# EasyEDA Pro project 多组分NO.2.eprj, board PCB1
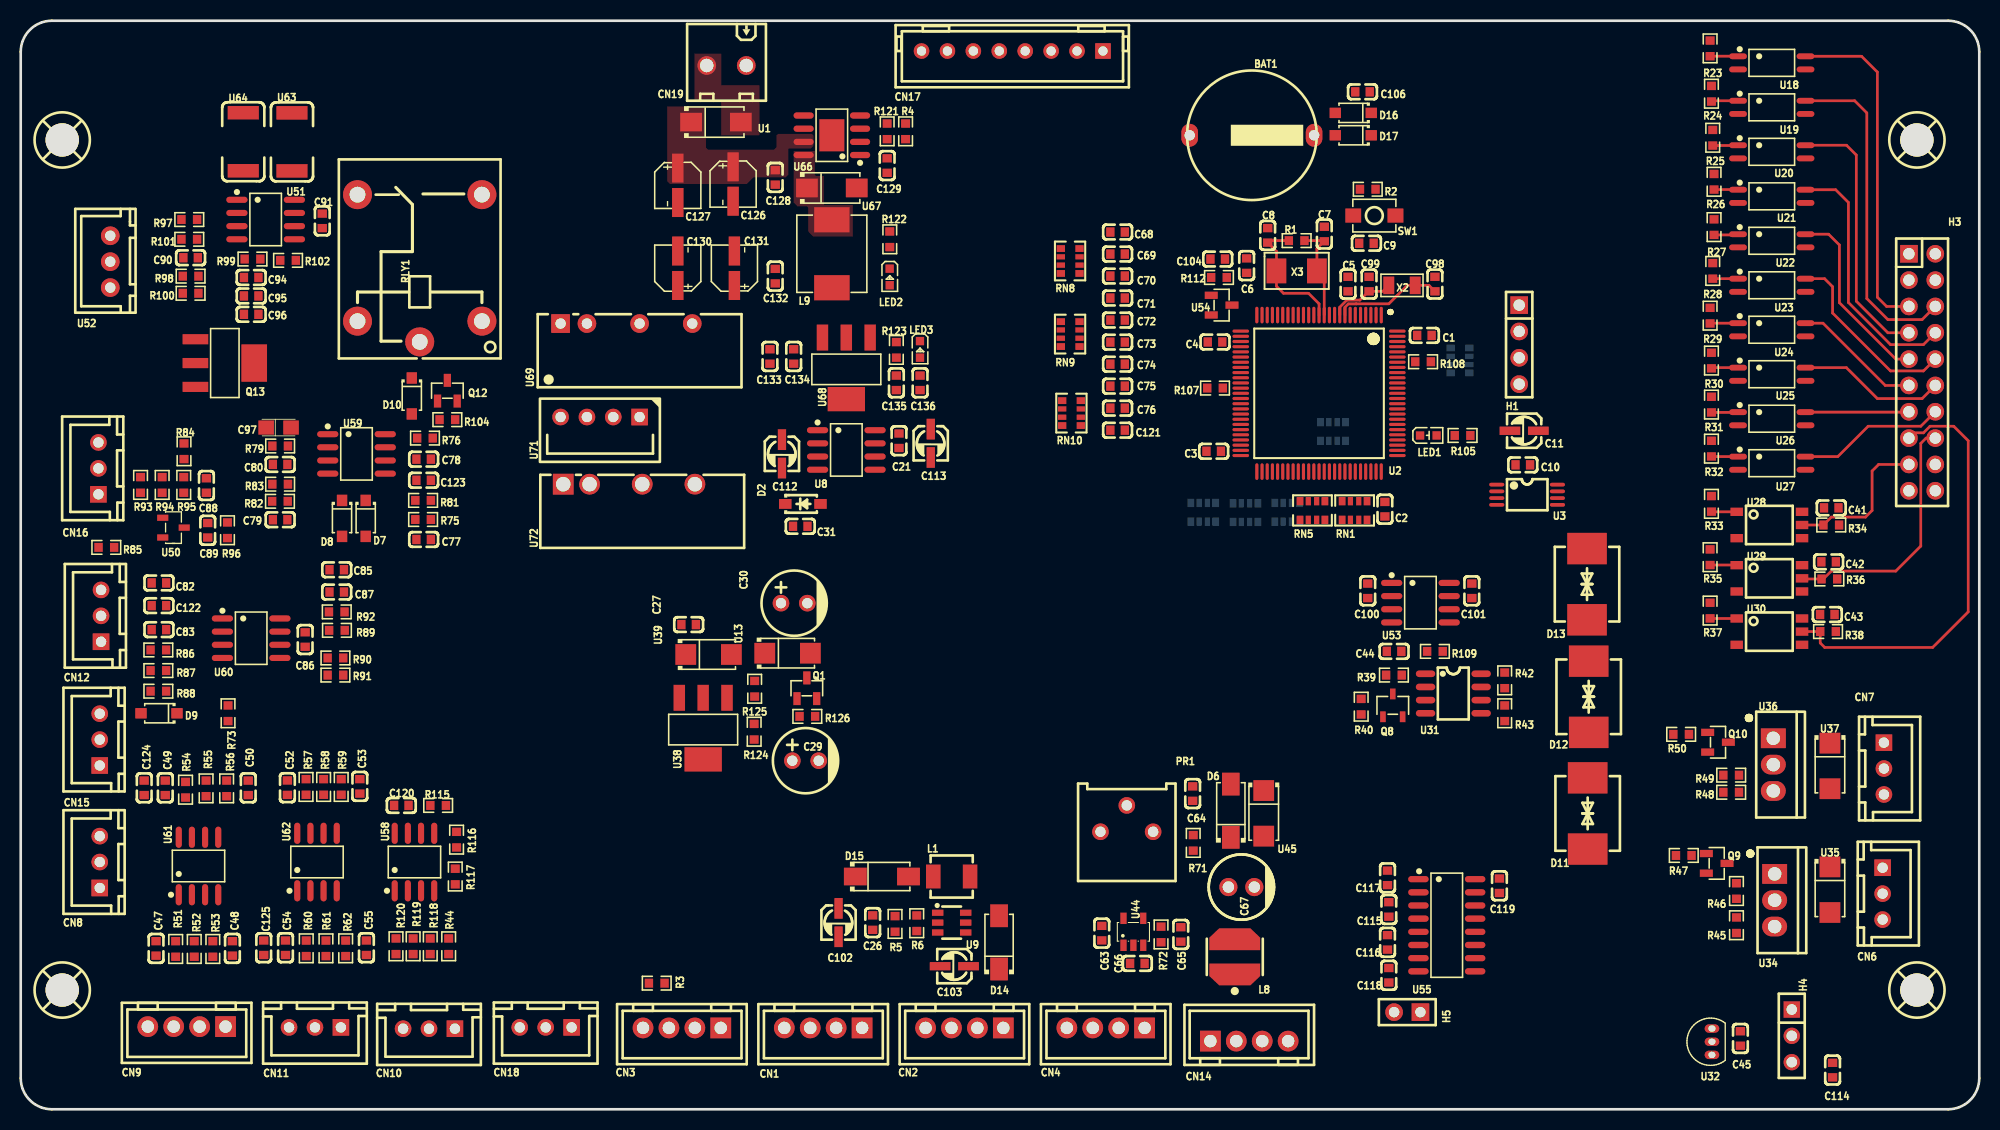
[diagram p5: board, top side]
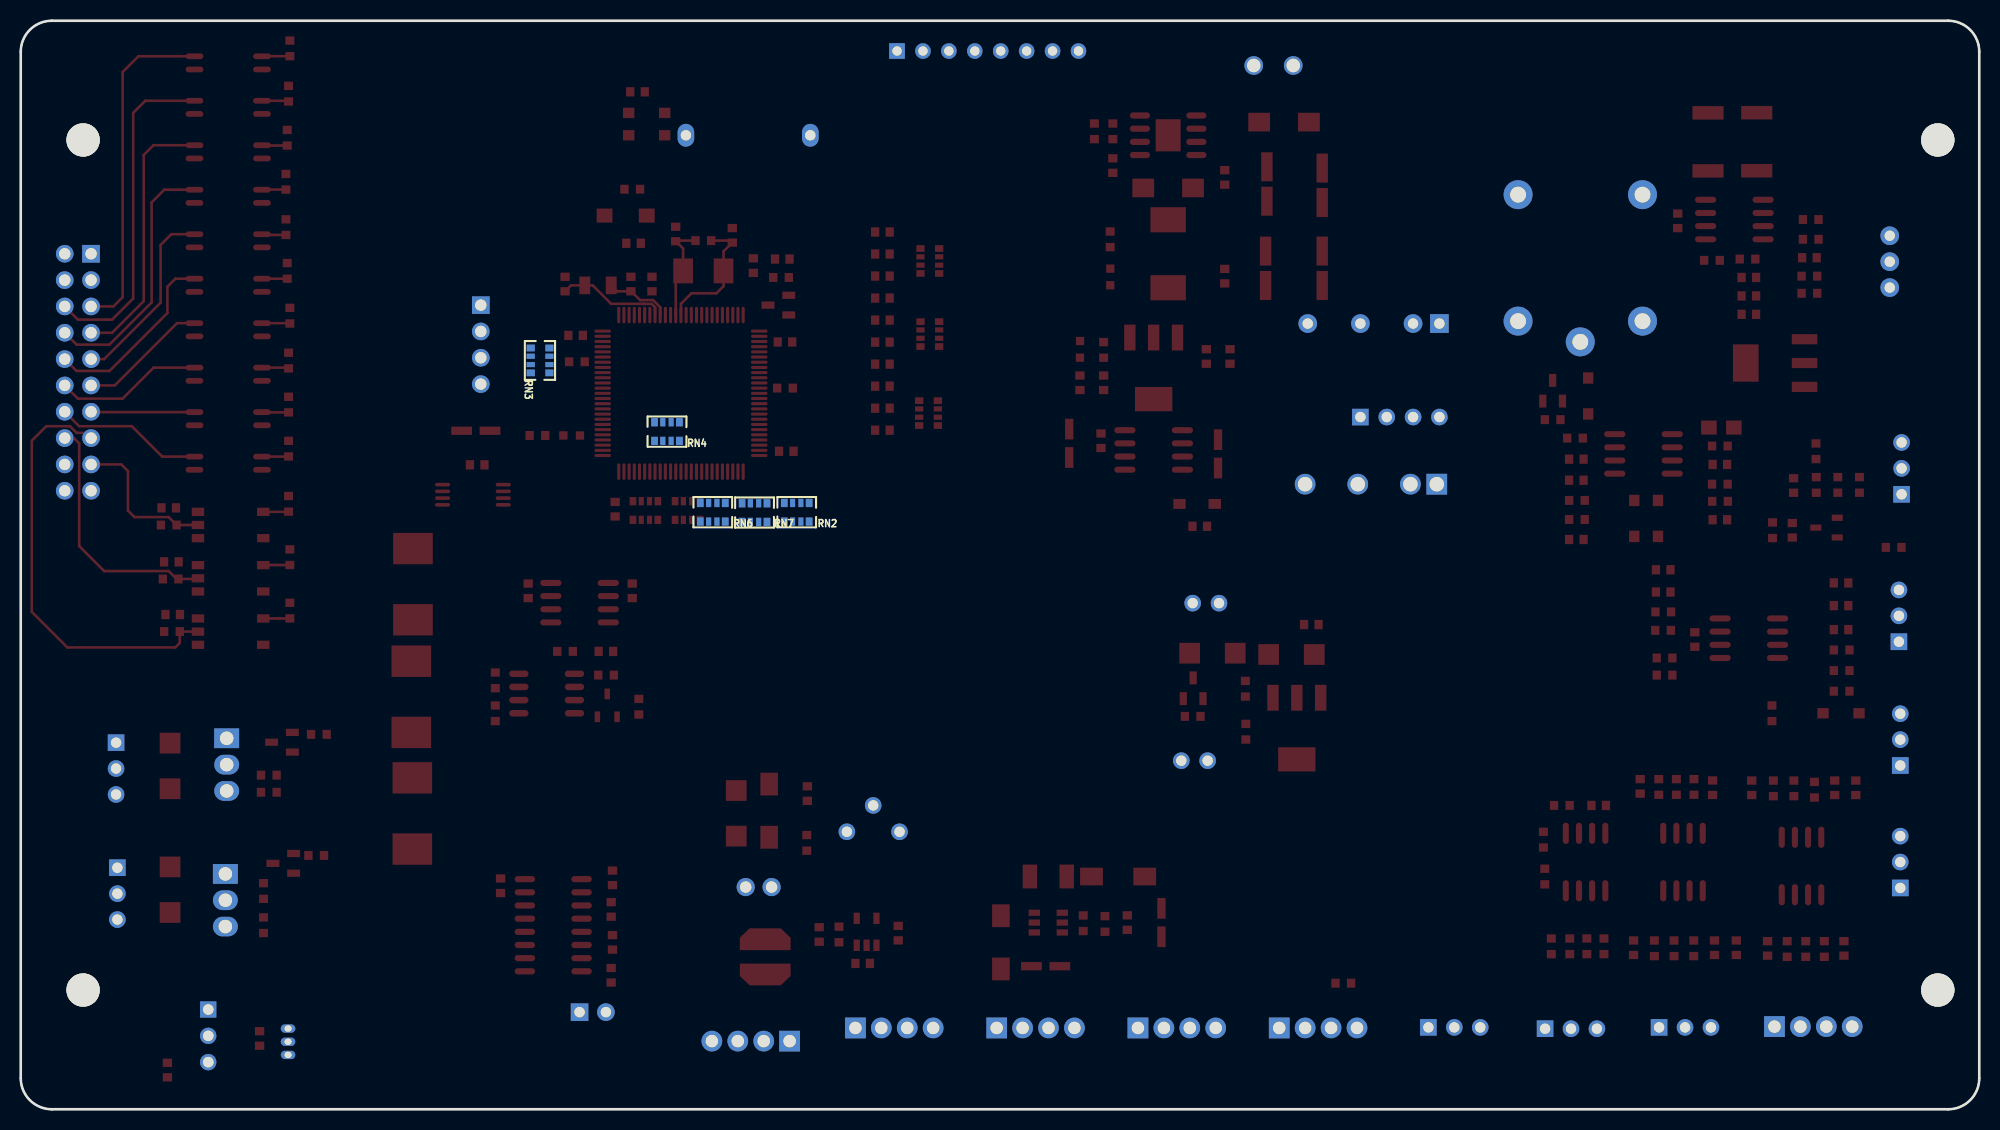
[diagram p6: board, bottom side, seen from below]

Outline 188.9 x 105 mm; copper layers: Top Layer, Bottom Layer. Coordinates in mm from the lower left corner of the outline.
Outline path: 0,102 0,3 arc(0.88,0.88) 3,0 185.9,0 arc(188.02,0.88) 188.9,3 188.9,102 arc(188.02,104.12) 185.9,105 3,105 arc(0.88,104.12) 0,102
Stack: Top Layer 0.035mm / Dielectric1 1.51mm FR4 er 4.5 / Bottom Layer 0.035mm

## Design rules (mm)
template: JLCPCB Capability(Two Layers Board)
spacing copperThickness1oz (default): track to track 0.102, other pairs 0.152 to 0.3
spacing copperThickness2oz: track to track 0.203, other pairs 0.152 to 0.3
track width copperThickness1oz (default): min 0.127, default 0.254, max 2.54
track width copperThickness2oz: min 0.203, default 0.254, max 2.54
differential pair differentialPair (default): width min 0.127, default 0.254, max 2.54; gap min 0.152, default 0.152
via viaSize (default): diameter min 0.5, default 0.61, max 10; hole min 0.3, default 0.305, max 6.3

## Placement (name value [footprint] x y rotation side)
BAT1  CR1220  [TH_BD12.5-P12.0-RD-CR1220]  118.75 93.95 0 top
C1  104  [C0603]  135.38 74.65 0 top
C2  100nF  [C0603]  131.57 57.88 270 top
C3  100nF  [C0603]  115.06 63.47 180 top
C4  100nF  [C0603]  115.19 74.01 180 top
C5  100nF  [C0603]  128.02 79.6 90 top
C6  100nF  [C0603]  118.24 81.38 90 top
C7  30pf  [C0603]  125.73 84.43 90 top
C8  30pf  [C0603]  120.27 84.3 90 top
C9  104  [C0603]  129.79 83.54 0 top
C10  104  [C0603]  144.87 62.16 180 top
C11  10uF/10V  [C_Ele_SMD_3x5.4mm]  145 65.46 0 top
C21  10uF  [C0603]  84.71 64.49 90 top
C26  104  [C0603]  82.17 18 90 top
C27  104  [C0603]  64.42 46.75 180 top
C29  220uF/25V  [CAP-TH_BD6.3-P2.50-D1.0-FD]  75.69 33.63 0 top
C30  220uF/25V  [CAP-TH_BD6.3-P2.50-D1.0-FD]  74.6 48.82 0 top
C31  104  [C0603]  75.18 56.23 180 top
C41  104  [C0603]  174.62 58.01 180 top
C42  104  [C0603]  174.37 52.8 0 top
C43  104  [C0603]  174.24 47.72 0 top
C44  104  [C0603]  132.46 44.17 180 top
C45  104  [C0603]  165.86 6.83 90 top
C47  104  [C0603]  13.05 15.52 270 top
C48  105  [C0603]  20.42 15.52 270 top
C49  104  [C0603]  13.94 31.01 90 top
C50  105  [C0603]  21.94 31.01 270 top
C52  104  [C0603]  25.72 31.02 270 top
C53  105  [C0603]  32.71 31.15 270 top
C54  104  [C0603]  25.54 15.58 90 top
C55  105  [C0603]  33.34 15.58 270 top
C63  104  [C0603]  104.27 16.99 270 top
C64  104  [C0603]  113.03 30.45 270 top
C65  105  [C0603]  111.89 16.86 270 top
C66  104  [C0603]  107.7 14.07 180 top
C67  100uF/25V  [CAP-TH_BD6.3-P2.50-D0.6-FD]  117.73 21.43 0 top
C68  104  [C0603]  105.79 84.62 180 top
C69  104  [C0603]  105.79 82.5 180 top
C70  104  [C0603]  105.79 80.37 180 top
C71  104  [C0603]  105.79 78.25 180 top
C72  104  [C0603]  105.79 76.12 180 top
C73  104  [C0603]  105.79 74 180 top
C74  104  [C0603]  105.79 71.88 180 top
C75  104  [C0603]  105.79 69.75 180 top
C76  104  [C0603]  105.79 67.63 180 top
C77  104  [C0603]  38.86 54.96 0 top
C78  105  [C0603]  38.86 62.71 0 top
C79  104  [C0603]  25.02 56.87 180 top
C80  105  [C0603]  25.02 62.2 180 top
C82  104  [C0603]  13.33 50.77 180 top
C83  105  [C0603]  13.33 46.27 0 top
C85  104  [C0603]  30.48 52.04 0 top
C86  105  [C0603]  27.43 45.31 270 top
C87  104  [C0603]  30.48 49.89 0 top
C88  104  [C0603]  17.91 60.17 270 top
C89  104  [C0603]  18.03 55.85 270 top
C90  104  [C0603]  16.38 82.14 0 top
C91  104  [C0603]  29.08 85.7 90 top
C94  2.2uf  [C0603]  22.22 80.23 180 top
C95  2.2uf  [C0603]  22.22 78.46 180 top
C96  2.2uf  [C0603]  22.22 76.68 180 top
C97  10uF/10v  [CASE-A_3216]  24.87 65.76 0 top
C98  15pf  [C0603]  136.4 79.6 90 top
C99  15pf  [C0603]  130.05 79.6 90 top
C100  104  [C0603]  129.92 50.01 270 top
C101  104  [C0603]  139.95 50.01 270 top
C102  22uF/10V  [C_Ele_SMD_3x5.4mm]  78.87 18 90 top
C103  22uF/10V  [C_Ele_SMD_3x5.4mm]  90.04 13.81 0 top
C104  104  [C0603]  115.45 82.01 180 top
C106  104  [C0603]  129.41 98.14 0 top
C112  10uF/10V  [C_Ele_SMD_3x5.4mm]  73.41 63.22 90 top
C113  10uF/10V  [C_Ele_SMD_3x5.4mm]  87.76 64.23 90 top
C114  100nF  [C0603]  174.75 3.78 90 top
C115  104  [C0603]  131.95 19.28 90 top
C116  104  [C0603]  131.83 16.1 90 top
C117  104  [C0603]  131.83 22.32 90 top
C118  104  [C0603]  131.95 12.93 90 top
C119  104  [C0603]  142.62 21.56 90 top
C120  104  [C0603]  36.71 29.31 0 top
C121  104  [C0603]  105.79 65.5 180 top
C122  104  [C0603]  13.33 48.58 0 top
C123  104  [C0603]  38.86 60.68 180 top
C124  104  [C0603]  11.91 31.01 270 top
C125  104  [C0603]  23.43 15.58 270 top
C126  4.7uF  [CAP-SMD_BD4.0-L4.3-W4.3-FD]  68.71 89.25 270 top
C127  4.7uF  [CAP-SMD_BD4.0-L4.3-W4.3-FD]  63.37 89.12 270 top
C128  100nF  [C0603]  72.77 89.89 90 top
C129  100nF  [C0603]  83.57 91.03 270 top
C130  47uF  [CAP-SMD_BD4.0-L4.3-W4.3-FD]  63.37 81.12 90 top
C131  47uF  [CAP-SMD_BD4.0-L4.3-W4.3-FD]  68.83 81.12 90 top
C132  100nF  [C0603]  72.77 80.36 270 top
C133  10uF  [C0603]  72.26 72.61 90 top
C134  100nF  [C0603]  74.55 72.61 90 top
C135  10uF  [C0603]  84.46 70.08 90 top
C136  100nF  [C0603]  86.74 70.08 90 top
CN1  WAFER-XH254Z-4A  [CONN-TH_XH-4A]  77.4 7.84 180 top
CN2  WAFER-XH254Z-4A  [CONN-TH_XH-4A]  91.02 7.84 180 top
CN3  WAFER-XH254Z-4A  [CONN-TH_XH-4A]  63.77 7.84 180 top
CN4  WAFER-XH254Z-4A  [CONN-TH_XH-4A]  104.65 7.84 180 top
CN6  WAFER-XH254Z-3AM  [CONN-TH_3P-P2.50_JS25T-S03XHW-00]  179.58 20.8 270 top
CN7  WAFER-XH254Z-3AM  [CONN-TH_3P-P2.50_JS25T-S03XHW-00]  179.71 32.86 270 top
CN8  WAFER-XH254Z-3AM  [CONN-TH_3P-P2.50_JS25T-S03XHW-00]  7.62 23.85 90 top
CN9  WAFER-XH254Z-4A  [CONN-TH_XH-4A]  16 7.97 180 top
CN10  WAFER-XH254Z-3AM  [CONN-TH_3P-P2.50_JS25T-S03XHW-00]  39.38 7.77 180 top
CN11  WAFER-XH254Z-3AM  [CONN-TH_3P-P2.50_JS25T-S03XHW-00]  28.38 7.9 180 top
CN12  WAFER-XH254Z-3AM  [CONN-TH_3P-P2.50_JS25T-S03XHW-00]  7.75 47.6 90 top
CN14  WAFER-XH254Z-4A  [CONN-TH_XH-4A]  118.49 6.57 0 top
CN15  WAFER-XH254Z-3AM  [CONN-TH_3P-P2.50_JS25T-S03XHW-00]  7.62 35.66 90 top
CN16  WAFER-XH254Z-3AM  [CONN-TH_3P-P2.50_JS25T-S03XHW-00]  7.49 61.82 90 top
CN17  WAFER-XH254Z-8A  [CONN-TH_WAFER-XH254Z-8A]  95.63 102.08 180 top
CN18  WAFER-XH254Z-3AM  [CONN-TH_3P-P2.50_JS25T-S03XHW-00]  50.63 7.9 180 top
CN19  MX128L-3.81-02P-GN01-Cu-Y-A  [CONN-TH_2P-P3.81_MX128L-3.81-GN01-02P-CU-Y-A]  68.07 100.68 180 top
D2  BZT52C10  [SOD-123_L2.7-W1.6-LS3.7-RD-1]  75.44 58.39 0 top
D6  SS14  [SMA_L4.2-W2.6-LS5.3-RD]  116.71 28.8 90 top
D7  1N4148W  [SOD-123F_L2.7-W1.6-LS3.8-RD]  33.27 56.99 270 top
D8  1N4148W  [SOD-123F_L2.7-W1.6-LS3.8-RD]  30.99 56.99 270 top
D9  1N4148W  [SOD-123F_L2.7-W1.6-LS3.8-RD]  13.34 38.2 180 top
D10  1N4148W  [SOD-123F_L2.7-W1.6-LS3.8-RD]  37.72 68.81 270 top
D11  SMCJ6.5CA  [SMC_L6.9-W5.9-LS7.9-BI]  151.13 28.53 90 top
D12  SMCJ6.5CA  [SMC_L6.9-W5.9-LS7.9-BI]  151.23 39.79 90 top
D13  SMCJ6.5CA  [SMC_L6.9-W5.9-LS7.9-BI]  151.07 50.65 90 top
D14  SS14  [SMA_L4.2-W2.6-LS5.3-RD]  94.36 16.1 90 top
D15  SS14  [SMA_L4.2-W2.6-LS5.3-RD]  83.06 22.45 0 top
D16  1N4148W  [SOD-123F_L2.7-W1.6-LS3.8-RD]  128.52 96.11 180 top
D17  1N4148W  [SOD-123F_L2.7-W1.6-LS3.8-RD]  128.52 93.95 180 top
H1  -  [HDR-TH_4P-P2.54-V-M]  144.53 73.76 270 top
H3  -  [HDR-TH_20P-P2.54-V-R2-C10-S2.54]  183.39 71.09 270 top
H4  -  [HDR-TH_3P-P2.54-V-F]  170.81 7.08 270 top
H5  -  [HDR-TH_2P-P2.54-V-F]  133.73 9.37 180 top
L1  3.3uH  [IND-SMD_L4.5-W4.1_SL0420]  89.79 22.45 0 top
L8  100uH  [IND-SMD_L5.0-W5.0-VLCF5028T]  117.09 14.7 0 top
L9  15uH  [IND-SMD_L7.3-W6.6]  78.23 82.52 90 top
LED1  NCD0603G1  [LED0603-RD_1]  135.76 65 0 top
LED2  -  [LED_0603]  83.82 80.23 270 top
LED3  -  [LED_0603]  86.74 73.25 270 top
PR1  10K  [R_3386P]  106.68 26.77 270 top
Q1  SS8550  [SOT-23-3_L2.9-W1.3-P1.90-LS2.4-BR]  75.82 40.61 270 top
Q8  S8050  [SOT-23-3_L3.0-W1.7-P0.95-LS2.9-BR]  132.33 38.96 270 top
Q9  SS8550  [SOT-23-3_L2.9-W1.3-P1.90-LS2.4-BR]  163.58 23.72 180 top
Q10  SS8550  [SOT-23-3_L2.9-W1.3-P1.90-LS2.4-BR]  163.7 35.4 180 top
Q12  SS8550  [SOT-23-3_L2.9-W1.3-P1.90-LS2.4-BR]  41.15 69.31 270 top
Q13  BSP149  [SOT-223-4_L6.5-W3.5-P2.30-LS7.0-BR]  19.69 71.98 180 top
R1  1M  [R0603]  123.06 83.79 0 top
R2  10K  [R0603]  129.92 88.74 180 top
R3  680  [R0603]  61.34 12.16 0 top
R4  3.16K  [R0603]  85.34 94.33 90 top
R5  100K  [R0603]  84.33 17.88 90 top
R6  10K  [R0603]  86.42 17.95 270 top
R23  300  [R0603]  162.94 102.33 90 top
R24  300  [R0603]  163.07 97.96 90 top
R25  300  [R0603]  163.19 93.71 90 top
R26  300  [R0603]  163.32 89.47 90 top
R27  300  [R0603]  163.32 85.09 90 top
R28  300  [R0603]  163.19 80.87 90 top
R29  300  [R0603]  162.94 76.55 90 top
R30  300  [R0603]  163.07 72.22 90 top
R31  300  [R0603]  163.07 67.97 90 top
R32  300  [R0603]  163.07 63.72 90 top
R33  390R  [R0603]  163.07 58.4 90 top
R34  10K  [R0603]  174.62 56.36 180 top
R35  390R  [R0603]  162.94 53.25 90 top
R36  10K  [R0603]  174.44 51.15 180 top
R37  390R  [R0603]  162.94 48.1 90 top
R38  10K  [R0603]  174.32 46.08 180 top
R39  4.7K  [R0603]  132.44 41.88 180 top
R40  4.7K  [R0603]  129.29 38.83 270 top
R42  4.7K  [R0603]  143.13 41.37 270 top
R43  4.7K  [R0603]  143.13 38.2 270 top
R44  0  [R0603]  41.28 15.72 90 top
R45  10K  [R0603]  165.48 17.75 270 top
R46  1K  [R0603]  165.48 21.05 270 top
R47  1K  [R0603]  160.4 24.48 0 top
R48  10K  [R0603]  164.97 30.58 180 top
R49  1K  [R0603]  164.97 32.23 0 top
R50  1K  [R0603]  160.15 36.17 0 top
R51  100R  [R0603]  14.94 15.46 90 top
R52  10K  [R0603]  16.73 15.46 90 top
R53  1K  [R0603]  18.53 15.46 270 top
R54  100R  [R0603]  15.9 30.83 90 top
R55  10K  [R0603]  17.88 30.95 90 top
R56  1K  [R0603]  19.86 30.95 270 top
R57  100  [R0603]  27.52 31.09 90 top
R58  10K  [R0603]  29.21 31.09 90 top
R59  1K  [R0603]  30.91 31.09 270 top
R60  100  [R0603]  27.54 15.53 90 top
R61  10K  [R0603]  29.44 15.53 90 top
R62  1K  [R0603]  31.34 15.53 270 top
R71  1K  [R0603]  113.09 25.7 90 top
R72  30K  [R0603]  109.98 16.86 90 top
R73  10.9K  [R0603]  20 38.2 90 top
R75  10K  [R0603]  38.81 56.89 180 top
R76  100K  [R0603]  38.99 64.74 180 top
R79  100K  [R0603]  25.02 63.98 0 top
R81  10K  [R0603]  38.81 58.73 180 top
R82  10K  [R0603]  25 58.64 0 top
R83  100K  [R0603]  25.02 60.3 180 top
R84  0  [R0603]  15.75 63.47 90 top
R85  0  [R0603]  8.26 54.2 180 top
R86  1M  [R0603]  13.27 44.3 180 top
R87  10K  [R0603]  13.27 42.32 0 top
R88  10K  [R0603]  13.27 40.33 0 top
R89  100R  [R0603]  30.5 46.2 0 top
R90  10K  [R0603]  30.35 43.53 0 top
R91  1K  [R0603]  30.35 41.88 180 top
R92  100R  [R0603]  30.48 47.98 180 top
R93  1K  [R0603]  11.56 60.22 90 top
R94  1M  [R0603]  13.64 60.22 90 top
R95  100R  [R0603]  15.72 60.22 270 top
R96  10K  [R0603]  19.94 55.85 90 top
R97  100R  [R0603]  16.26 85.82 0 top
R98  1K  [R0603]  16.38 80.36 180 top
R99  300K  [R0603]  22.35 82.01 0 top
R100  1M  [R0603]  16.38 78.71 180 top
R101  0  [R0603]  16.26 83.92 0 top
R102  300  [R0603]  25.78 81.89 0 top
R104  1K  [R0603]  41.15 66.52 0 top
R105  10K  [R0603]  139.06 65 0 top
R107  10K  [R0603]  115.19 69.57 0 top
R108  10K  [R0603]  135.25 72.11 0 top
R109  1K  [R0603]  136.4 44.17 180 top
R112  10K  [R0603]  115.57 80.23 180 top
R115  10K  [R0603]  40.26 29.31 0 top
R116  3K  [R0603]  42.04 26.01 270 top
R117  2K  [R0603]  41.91 22.45 270 top
R118  10K  [R0603]  39.5 15.72 90 top
R119  390  [R0603]  37.85 15.72 90 top
R120  10K  [R0603]  36.19 15.72 270 top
R121  10K  [R0603]  83.57 94.33 270 top
R122  5K  [R0603]  83.82 83.92 270 top
R123  2K  [R0603]  84.46 73.25 90 top
R124  100  [R0603]  70.74 36.42 270 top
R125  100K  [R0603]  70.79 40.56 270 top
R126  10K  [R0603]  75.87 37.9 0 top
RLY1  SRD-05VDC-SL-C  [RELAY-TH_SRD-XXVDC-XL-C]  38.48 81.12 90 top
RN1  10kΩ  [RES-ARRAY-SMD_0603-8P-L3.2-W1.6-BL]  128.65 57.76 0 top
RN2  10kΩ  [RES-ARRAY-SMD_0603-8P-L3.2-W1.6-BL]  114.06 57.59 180 bottom
RN3  10kΩ  [RES-ARRAY-SMD_0603-8P-L3.2-W1.6-BL]  138.81 72.23 90 bottom
RN4  10kΩ  [RES-ARRAY-SMD_0603-8P-L3.2-W1.6-BL]  126.57 65.38 0 bottom
RN5  10kΩ  [RES-ARRAY-SMD_0603-8P-L3.2-W1.6-BL#2]  124.59 57.76 0 top
RN6  10kΩ  [RES-ARRAY-SMD_0603-8P-L3.2-W1.6-BL]  122.15 57.59 180 bottom
RN7  10kΩ  [RES-ARRAY-SMD_0603-8P-L3.2-W1.6-BL#2]  118.12 57.55 180 bottom
RN8  390R  [RES-ARRAY-SMD_0603-8P-L3.2-W1.6-BL]  101.22 81.83 90 top
RN9  390R  [RES-ARRAY-SMD_0603-8P-L3.2-W1.6-BL]  101.22 74.77 90 top
RN10  390R  [RES-ARRAY-SMD_0603-8P-L3.2-W1.6-BL]  101.35 67.15 90 top
SCREW1  -  [M3螺丝]  4 93.5 0 top
SCREW2  -  [M3螺丝]  182.89 93.5 0 top
SCREW3  -  [M3螺丝]  4 11.5 0 top
SCREW4  -  [M3螺丝]  182.89 11.5 0 top
SW1  TS342A2P-WZ  [SW-SMD_L4.0-W2.9-LS5.0]  130.56 86.2 180 top
U1  SS54  [SMA_L4.2-W2.6-LS5.1-RD]  67.06 95.22 0 top
U2  STM32F103VCT6  [LQFP-100_L14.0-W14.0-P0.50-LS16.0-BL]  125.22 69.06 180 top
U3  FM24C256E-TS-T-G  [TSSOP-8_L4.4-W3.0-P0.65-LS6.4-BL]  145.29 59.28 270 top
U8  TC7660EOA  [SOIC-8_L4.9-W3.9-P1.27-LS6.0-BL]  79.63 63.6 270 top
U9  SX1301  [SOT-23-6_L2.9-W1.6-P0.95-LS2.8-BR]  89.79 18 180 top
U13  1N4007  [SMA_L4.3-W2.6-LS5.1-RD]  73.96 43.99 0 top
U18  TLP281  [SOP-4_L4.4-W2.6-P1.27-LS7.0-TL]  168.89 100.94 0 top
U19  TLP281  [SOP-4_L4.4-W2.6-P1.27-LS7.0-TL]  168.89 96.65 0 top
U20  TLP281  [SOP-4_L4.4-W2.6-P1.27-LS7.0-TL]  168.89 92.35 0 top
U21  TLP281  [SOP-4_L4.4-W2.6-P1.27-LS7.0-TL]  168.89 88.06 0 top
U22  TLP281  [SOP-4_L4.4-W2.6-P1.27-LS7.0-TL]  168.89 83.77 0 top
U23  TLP281  [SOP-4_L4.4-W2.6-P1.27-LS7.0-TL]  168.89 79.48 0 top
U24  TLP281  [SOP-4_L4.4-W2.6-P1.27-LS7.0-TL]  168.89 75.19 0 top
U25  TLP281  [SOP-4_L4.4-W2.6-P1.27-LS7.0-TL]  168.89 70.9 0 top
U26  TLP281  [SOP-4_L4.4-W2.6-P1.27-LS7.0-TL]  168.89 66.61 0 top
U27  TLP281  [SOP-4_L4.4-W2.6-P1.27-LS7.0-TL]  168.89 62.32 0 top
U28  TLP112(F)  [SOIC-5_L4.4-W3.6-P1.27-LS7.0-BL]  168.66 56.36 270 top
U29  TLP112(F)  [SOIC-5_L4.4-W3.6-P1.27-LS7.0-BL]  168.66 51.22 270 top
U30  TLP112(F)  [SOIC-5_L4.4-W3.6-P1.27-LS7.0-BL]  168.66 46.07 270 top
U31  MAX485ESA  [SOP-8_L4.9-W3.9-P1.27-LS6.0-BL]  138.18 40.1 270 top
U32  DS18B20  [TO-92-3_L4.6-W3.6-P1.27-L-1]  163.12 6.51 90 top
U34  TIP102  [TO-220-3_L10.0-W4.6-P2.54-L]  169.16 20.16 270 top
U35  1N4007  [SMA_L4.3-W2.6-LS5.1-RD]  174.5 21.18 270 top
U36  TIP102  [TO-220-3_L10.0-W4.6-P2.54-L]  169.04 33.25 270 top
U37  1N4007  [SMA_L4.3-W2.6-LS5.1-RD]  174.5 33.12 270 top
U38  LM317DCYR-MS  [SOT-223-3_L6.5-W3.4-P2.30-LS7.0-BR-1]  65.82 36.72 90 top
U39  1N4007  [SMA_L4.3-W2.6-LS5.1-RD]  66.34 43.87 0 top
U44  LMV321  [SOT-23-5_L3.0-W1.7-P0.95-LS2.8-BR]  107.31 17.12 270 top
U45  1N4007  [SMA_L4.3-W2.6-LS5.1-RD]  119.89 28.55 270 top
U50  LM385-1.2  [SOT-23-3_L2.9-W1.4-P1.90-LS2.5-BR]  14.73 56.11 180 top
U51  TLC2652I-8DR  [SOIC-8_L4.9-W3.9-P1.27-LS6.0-BL]  23.62 85.82 270 top
U52  WAFER-XH254Z-3A  [CONN-TH_XH-3A]  8.64 81.76 90 top
U53  ADUM3201ARZ  [SOIC-8_L4.9-W3.9-P1.27-LS6.0-BL]  135 48.87 270 top
U54  TL431ACL3T  [SOT-23-3_L2.9-W1.3-P1.90-LS2.4-BR]  115.82 77.57 180 top
U55  MAX232ESE+T  [SOIC-16_L9.9-W3.9-P1.27-LS6.0-BL]  137.54 17.75 270 top
U58  LM258  [SOIC-8_L4.9-W3.9-P1.27-LS6.0-BL]  37.97 23.85 0 top
U59  GS8552-SR  [SOIC-8_L4.9-W3.9-P1.27-LS6.0-BL]  32.39 63.22 270 top
U60  GS8552-SR  [SOIC-8_L4.9-W3.9-P1.27-LS6.0-BL]  22.22 45.44 270 top
U61  GS8552-SR  [SOIC-8_L4.9-W3.9-P1.27-LS6.0-BL]  17.14 23.47 0 top
U62  GS8552-SR  [SOIC-8_L4.9-W3.9-P1.27-LS6.0-BL]  28.58 23.85 0 top
U63  100nF  [CAP-SMD_L4.8-W3.3_1]  26.16 93.32 270 top
U64  100nF  [CAP-SMD_L4.8-W3.3_1]  21.46 93.33 270 top
U66  TPS5450QDDARQ1  [SOIC-8_L4.9-W3.9-P1.27-LS6.0-BL-EP]  78.23 93.95 90 top
U67  SS54  [SMA_L4.2-W2.6-LS5.1-RD]  78.23 88.87 0 top
U68  AMS1117-3.3  [SOT-223-3_L6.5-W3.4-P2.30-LS7.0-BR]  79.63 71.47 90 top
U69  B0505S-2WR3  [PWRM-TH_BXXXXS-2WR3]  58.42 75.79 0 top
U71  B1212S-1WR3  [PWRM-TH_4P-L11.5-W6.1-P2.54_TME1212S]  55.88 66.77 180 top
U72  B1224S-2WR2  [PWRM-TH_YLPTEC_BXXXXS-2WR2]  58.67 60.3 0 top
X2  32.768kHz  [OSC-SMD_L3.2-W1.5]  133.22 79.47 0 top
X3  8MHz  [CRYSTAL-SMD_2P-L5.0-W3.2]  123.06 80.87 0 top

## Footprints (pads in the part's own frame, mm; a bottom-side part is the same pattern mirrored in y, then rotated)
C0603
  rect 0.8x0.9 smd: 1(-0.7,0) 2(0.7,0)
C_Ele_SMD_3x5.4mm
  rect 1.999x0.8 smd: 1(1.374,-0.014) 2(-1.364,-0.014)
CAP-SMD_BD4.0-L4.3-W4.3-FD
  rect 2.8x1.1 smd: 1(-1.661,0) 2(1.661,0)
CAP-SMD_L4.8-W3.3_1
  rect 1.3x3 smd: 1(-2.8,0) 2(2.8,0)
CAP-TH_BD6.3-P2.50-D0.6-FD
  round 1.75 hole 1.1: 1(-1.25,0) 2(1.25,0)
CAP-TH_BD6.3-P2.50-D1.0-FD
  round 1.6 hole 1: 1(-1.27,0) 2(1.27,0)
CASE-A_3216
  rect 1.5x1.359 smd: 1(-1.2,0) 2(1.2,0)
CONN-TH_2P-P3.81_MX128L-3.81-GN01-02P-CU-Y-A
  round 1.8 hole 1.3: 1(-1.905,0) 2(1.905,0)
CONN-TH_3P-P2.50_JS25T-S03XHW-00
  rect 1.6x1.6 hole 1: 1(-2.5,0)
  round 1.6 hole 1: 2(0,0) 3(2.5,0)
CONN-TH_WAFER-XH254Z-8A
  rect 1.5x1.5 hole 0.9: 1(-8.75,0)
  round 1.5 hole 0.9: 2(-6.25,0) 3(-3.75,0) 4(-1.25,0) 5(1.25,0) 6(3.75,0) 7(6.25,0) 8(8.75,0)
CONN-TH_XH-3A
  round 1.8 hole 1: 1(-2.5,0) 2(0,0) 3(2.5,0)
CONN-TH_XH-4A
  rect 2x2 hole 1.2: 1(-3.75,0)
  round 2 hole 1.2: 2(-1.25,0) 3(1.25,0) 4(3.75,0)
CRYSTAL-SMD_2P-L5.0-W3.2
  rect 1.9x2.4 smd: 1(-1.95,0) 2(1.95,0)
HDR-TH_2P-P2.54-V-F
  rect 1.7x1.7 hole 1: 1(-1.27,0)
  round 1.7 hole 1: 2(1.27,0)
HDR-TH_3P-P2.54-V-F
  rect 1.575x1.575 hole 1.02: 1(-2.54,0)
  round 1.575 hole 1.02: 2(0,0) 3(2.54,0)
HDR-TH_4P-P2.54-V-M
  rect 1.7x1.7 hole 1.1: 1(-3.81,0)
  round 1.7 hole 1.1: 2(-1.27,0) 3(1.27,0) 4(3.81,0)
HDR-TH_20P-P2.54-V-R2-C10-S2.54
  rect 1.7x1.7 hole 1.1: 1(-11.43,-1.27)
  round 1.7 hole 1.1: 2(-11.43,1.27) 3(-8.89,-1.27) 4(-8.89,1.27) 5(-6.35,-1.27) 6(-6.35,1.27) 7(-3.81,-1.27) 8(-3.81,1.27) 9(-1.27,-1.27) 10(-1.27,1.27) 11(1.27,-1.27) 12(1.27,1.27) 13(3.81,-1.27) 14(3.81,1.27) 15(6.35,-1.27) 16(6.35,1.27) 17(8.89,-1.27) 18(8.89,1.27) 19(11.43,-1.27) 20(11.43,1.27)
IND-SMD_L4.5-W4.1_SL0420
  rect 1.4x2.3 smd: 1(-1.775,0) 2(1.775,0)
IND-SMD_L5.0-W5.0-VLCF5028T
  custom 4.9x2.1 smd: 1(0,-1.7) 2(0,1.7)
IND-SMD_L7.3-W6.6
  rect 2.424x3.42 smd: 1(3.278,0) 2(-3.278,0)
LED0603-RD_1
  rect 0.8x0.8 smd: 1(-0.799,-0.004) 2(0.799,0.004)
LED_0603
  rect 0.8x0.8 smd: 1(-0.851,-0.01) 2(0.75,-0.005)
LQFP-100_L14.0-W14.0-P0.50-LS16.0-BL
  oval 0.3x1.6 smd: 1(-6,-7.55) 2(-5.5,-7.55) 3(-5,-7.55) 4(-4.5,-7.55) 5(-4,-7.55) 6(-3.5,-7.55) 7(-3,-7.55) 8(-2.5,-7.55) 9(-2,-7.55) 10(-1.5,-7.55) 11(-1,-7.55) 12(-0.5,-7.55) 13(0,-7.55) 14(0.5,-7.55) 15(1,-7.55) 16(1.5,-7.55) 17(2,-7.55) 18(2.5,-7.55) 19(3,-7.55) 20(3.5,-7.55) 21(4,-7.55) 22(4.5,-7.55) 23(5,-7.55) 24(5.5,-7.55) 25(6,-7.55) 51(6,7.55) 52(5.5,7.55) 53(5,7.55) 54(4.5,7.55) 55(4,7.55) 56(3.5,7.55) 57(3,7.55) 58(2.5,7.55) 59(2,7.55) 60(1.5,7.55) 61(1,7.55) 62(0.5,7.55) 63(0,7.55) 64(-0.5,7.55) 65(-1,7.55) 66(-1.5,7.55) 67(-2,7.55) 68(-2.5,7.55) 69(-3,7.55) 70(-3.5,7.55) 71(-4,7.55) 72(-4.5,7.55) 73(-5,7.55) 74(-5.5,7.55) 75(-6,7.55)
  oval 1.6x0.3 smd: 26(7.55,-6) 27(7.55,-5.5) 28(7.55,-5) 29(7.55,-4.5) 30(7.55,-4) 31(7.55,-3.5) 32(7.55,-3) 33(7.55,-2.5) 34(7.55,-2) 35(7.55,-1.5) 36(7.55,-1) 37(7.55,-0.5) 38(7.55,0) 39(7.55,0.5) 40(7.55,1) 41(7.55,1.5) 42(7.55,2) 43(7.55,2.5) 44(7.55,3) 45(7.55,3.5) 46(7.55,4) 47(7.55,4.5) 48(7.55,5) 49(7.55,5.5) 50(7.55,6) 76(-7.55,6) 77(-7.55,5.5) 78(-7.55,5) 79(-7.55,4.5) 80(-7.55,4) 81(-7.55,3.5) 82(-7.55,3) 83(-7.55,2.5) 84(-7.55,2) 85(-7.55,1.5) 86(-7.55,1) 87(-7.55,0.5) 88(-7.55,0) 89(-7.55,-0.5) 90(-7.55,-1) 91(-7.55,-1.5) 92(-7.55,-2) 93(-7.55,-2.5) 94(-7.55,-3) 95(-7.55,-3.5) 96(-7.55,-4) 97(-7.55,-4.5) 98(-7.55,-5) 99(-7.55,-5.5) 100(-7.55,-6)
M3螺丝
  round 3.2 hole 3.2: 1(0,0)
OSC-SMD_L3.2-W1.5
  rect 1.05x1.7 smd: 1(-1.275,0) 2(1.275,0)
PWRM-TH_4P-L11.5-W6.1-P2.54_TME1212S
  rect 1.6x1.6 hole 1: 1(-3.81,0)
  round 1.6 hole 1: 2(-1.27,0) 3(1.27,0) 4(3.81,0)
PWRM-TH_BXXXXS-2WR3
  rect 1.8x1.8 hole 1: 1(-6.35,0)
  round 1.8 hole 1: 2(-3.81,0) 4(1.27,0) 6(6.35,0)
PWRM-TH_YLPTEC_BXXXXS-2WR2
  rect 2x2 hole 1.4: 1(-6.35,0)
  round 2 hole 1.4: 2(-3.81,0) 4(1.27,0) 6(6.35,0)
R0603
  rect 0.806x0.864 smd: 1(-0.753,0) 2(0.753,0)
R_3386P
  round 1.6 hole 1.001: 1(0,-2.54) 2(-2.54,0) 3(0,2.54)
RELAY-TH_SRD-XXVDC-XL-C
  round 2.794 hole 1.524: 1(-5.1,-6) 2(7.1,-6) 3(7.1,6) 4(-5.1,6) 5(-7.1,0)
RES-ARRAY-SMD_0603-8P-L3.2-W1.6-BL
  rect 0.65x0.8 smd: 1(-1.2,-0.9) 4(1.2,-0.9) 5(1.2,0.9) 8(-1.2,0.9)
  rect 0.5x0.8 smd: 2(-0.4,-0.9) 3(0.4,-0.9) 6(0.4,0.9) 7(-0.4,0.9)
RES-ARRAY-SMD_0603-8P-L3.2-W1.6-BL#2
  rect 0.65x0.8 smd: 1(1.2,-0.9) 4(-1.2,-0.9) 5(-1.2,0.9) 8(1.2,0.9)
  rect 0.5x0.8 smd: 2(0.4,-0.9) 3(-0.4,-0.9) 6(-0.4,0.9) 7(0.4,0.9)
SMA_L4.2-W2.6-LS5.1-RD
  rect 2.1x1.8 smd: 1(-2.4,0) 2(2.4,0)
SMA_L4.2-W2.6-LS5.3-RD
  rect 2.2x1.7 smd: 1(-2.566,0) 2(2.566,0)
SMA_L4.3-W2.6-LS5.1-RD
  rect 2x2 smd: 1(-2.2,0) 2(2.2,0)
SMC_L6.9-W5.9-LS7.9-BI
  rect 3.03x3.82 smd: 1(-3.435,0) 2(3.435,0)
SOD-123_L2.7-W1.6-LS3.7-RD-1
  rect 1.2x0.95 smd: 1(-1.7,0) 2(1.7,0)
SOD-123F_L2.7-W1.6-LS3.8-RD
  rect 1.1x1 smd: 1(-1.735,0) 2(1.735,0)
SOIC-5_L4.4-W3.6-P1.27-LS7.0-BL
  rect 0.8x1.2 smd: 1(-1.27,-3.15) 3(1.27,-3.15) 4(1.27,3.15) 5(0,3.15) 6(-1.27,3.15)
SOIC-8_L4.9-W3.9-P1.27-LS6.0-BL
  oval 0.588x2.045 smd: 1(-1.905,-2.772) 2(-0.635,-2.772) 3(0.635,-2.772) 4(1.905,-2.772) 5(1.905,2.772) 6(0.635,2.772) 7(-0.635,2.772) 8(-1.905,2.772)
SOIC-8_L4.9-W3.9-P1.27-LS6.0-BL-EP
  oval 0.602x1.941 smd: 1(-1.905,-2.72) 2(-0.635,-2.72) 3(0.635,-2.72) 4(1.905,-2.72) 5(1.905,2.72) 6(0.635,2.72) 7(-0.635,2.72) 8(-1.905,2.72)
  rect 3.098x2.41 smd: 9(0,0)
SOIC-16_L9.9-W3.9-P1.27-LS6.0-BL
  oval 0.602x1.971 smd: 1(-4.445,-2.736) 2(-3.175,-2.736) 3(-1.905,-2.736) 4(-0.635,-2.736) 5(0.635,-2.736) 6(1.905,-2.736) 7(3.175,-2.736) 8(4.445,-2.736) 9(4.445,2.736) 10(3.175,2.736) 11(1.905,2.736) 12(0.635,2.736) 13(-0.635,2.736) 14(-1.905,2.736) 15(-3.175,2.736) 16(-4.445,2.736)
SOP-4_L4.4-W2.6-P1.27-LS7.0-TL
  oval 1.71x0.56 smd: 1(-3.255,0.635) 2(-3.255,-0.635) 3(3.255,-0.635) 4(3.255,0.635)
SOP-8_L4.9-W3.9-P1.27-LS6.0-BL
  oval 0.63x1.865 smd: 1(-1.905,-2.683) 2(-0.635,-2.683) 3(0.635,-2.683) 4(1.905,-2.683) 5(1.905,2.683) 6(0.635,2.683) 7(-0.635,2.683) 8(-1.905,2.683)
SOT-23-3_L2.9-W1.3-P1.90-LS2.4-BR
  rect 1.25x0.7 smd: 1(1,-0.95) 2(1,0.95) 3(-1,0)
SOT-23-3_L2.9-W1.4-P1.90-LS2.5-BR
  rect 1.07x0.6 smd: 1(1.035,-0.95) 2(1.035,0.95) 3(-1.035,0)
SOT-23-3_L3.0-W1.7-P0.95-LS2.9-BR
  rect 1.038x0.532 smd: 1(1.101,-0.95) 2(1.101,0.95) 3(-1.101,0)
SOT-23-5_L3.0-W1.7-P0.95-LS2.8-BR
  rect 1.1x0.6 smd: 1(1.3,-0.95) 2(1.3,0) 3(1.3,0.95) 4(-1.3,0.95) 5(-1.3,-0.95)
SOT-23-6_L2.9-W1.6-P0.95-LS2.8-BR
  rect 1.1x0.6 smd: 1(1.35,-0.95) 2(1.35,0) 3(1.35,0.95) 4(-1.35,0.95) 5(-1.35,0) 6(-1.35,-0.95)
SOT-223-3_L6.5-W3.4-P2.30-LS7.0-BR
  rect 2.5x1.1 smd: 1(2.97,-2.3) 2(2.97,0) 3(2.97,2.3)
  rect 2.34x3.6 smd: 4(-2.97,0)
SOT-223-3_L6.5-W3.4-P2.30-LS7.0-BR-1
  rect 2.5x1.1 smd: 1(2.97,-2.3) 2(2.97,0) 3(2.97,2.3)
  rect 2.34x3.6 smd: 2(-2.97,0)
SOT-223-4_L6.5-W3.5-P2.30-LS7.0-BR
  rect 2.47x0.98 smd: 1(2.835,-2.3) 2(2.835,0) 3(2.835,2.3)
  rect 2.47x3.6 smd: 4(-2.835,0)
SW-SMD_L4.0-W2.9-LS5.0
  rect 1.53x1.36 smd: 1(-2.035,0) 2(2.035,0)
TH_BD12.5-P12.0-RD-CR1220
  oval 1.6x2.2 hole 1: 1(-6,0) 2(6,0)
TO-92-3_L4.6-W3.6-P1.27-L-1
  oval 0.8x1.4 hole 0.6x0.682: 1(-1.27,0) 2(0,0) 3(1.27,0)
TO-220-3_L10.0-W4.6-P2.54-L
  rect 1.9x2.4 hole 1.3: 1(-2.54,0)
  oval 1.9x2.4 hole 1.3: 2(0,0) 3(2.54,0)
TSSOP-8_L4.4-W3.0-P0.65-LS6.4-BL
  oval 0.353x1.454 smd: 1(-0.975,-2.927) 2(-0.325,-2.927) 3(0.325,-2.927) 4(0.975,-2.927) 5(0.975,2.927) 6(0.325,2.927) 7(-0.325,2.927) 8(-0.975,2.927)

## Nets
As in the schematic.

Pads without a net: CN6 2; CN7 2; CN17 3; H3 18; RLY1 3; RN10 2 3 6 7; SCREW1 1; SCREW2 1; SCREW3 1; SCREW4 1; U2 1 2 3 4 5 7 33 34 35 36 38 39 40 41 42 43 44 45 46 53 70 71 73 77 81 82 83 84 85 86 87 88 89 90 91 97 98; U8 1 6 7; U9 6; U51 5; U55 11 12 13 14; U66 2 3 5

## Routing (per net, layer and track width the routed paths; a pad name or vN(x,y) marks a point on that pad's centre or on a via; arc(x,y) is an arc through that point)
DA_CLK_O: length 24.3
  Top Layer w0.254: H3.16 183.77,64.74 183.26,64.23 183.26,54.33 180.85,51.91 174.62,51.91 173.86,51.15 R36.2 171.87,51.15 U29.5
DA_MOSI_O: length 15
  Top Layer w0.254: H3.17 179.2,62.2 178.56,61.57 178.56,57.76 177.93,57.12 174.63,57.12 R34.2 U28.5
DA_SYNC_O: length 42
  Top Layer w0.254: H3.15 182.63,65.25 183.51,65.25 184.15,65.88 186.44,65.88 187.83,64.49 187.83,47.98 184.4,44.55 173.99,44.55 173.56,44.98 R38.2 171.81,46.08 U30.5
HEAT_O: length 32.7
  Top Layer w0.254: U18.4 177.55,101.57 179.07,100.05 179.07,78.33 179.96,77.44 H3.5
OSC_IN: length 9.6
  Top Layer w0.254: 125.71,83.73 C7.1 ; 125.71,83.73 125.65,83.79 R1.2 ; 125.71,83.73 125.01,83.03 X3.2 125.72,80.16 U2.12
OSC_IN1: length 10.5
  Top Layer w0.254: C98.1 135.82,79.47 X2.2 133.73,79.47 131.95,77.69 128.81,77.69 128.8,77.69 128.04,77.69 127.72,77.37 U2.8
OSC_OUT: length 12.6
  Top Layer w0.254: R1.1 120.46,83.79 C8.1 121.11,82.75 X3.1 121.11,79.39 121.79,78.71 124.21,78.71 125.22,77.69 U2.13
OSC_OUT1: length 6.4
  Top Layer w0.254: U2.9 127.22,77.37 127.9,78.05 129.16,78.05 130.01,78.9 C99.1 131.38,78.9 X2.1
PUMP_O: length 32.3
  Top Layer w0.254: H3.6 183.39,76.17 180.09,76.17 178.05,78.2 178.05,96.11 176.88,97.28 U19.4
RL1_O: length 25.7
  Top Layer w0.254: U20.4 176.09,92.99 177.04,92.05 177.04,77.95 180.09,74.9 H3.7
RL2_O: length 24.8
  Top Layer w0.254: U21.4 175.05,88.7 176.28,87.47 176.28,77.82 180.34,73.76 183.51,73.76 H3.8
RL3_O: length 18.2
  Top Layer w0.254: U22.4 174.37,84.41 175.41,83.37 175.41,77.8 180.85,72.36 H3.9
RL4_O: length 18.2
  Top Layer w0.254: U23.4 173.98,80.12 174.75,79.35 174.75,76.81 180.34,71.22 183.51,71.22 H3.10
RL5_O: length 12.5
  Top Layer w0.254: U24.4 173.83,75.83 179.83,69.82 H3.11
RL6_O: length 14.3
  Top Layer w0.254: H3.12 183.39,68.55 179.07,68.55 176.08,71.54 U25.4
RL7_O: length 10
  Top Layer w0.254: H3.13 182.08,67.25 U26.4
RL8_O: length 14.3
  Top Layer w0.254: U27.4 175.25,62.95 178.18,65.88 183.26,65.88 H3.14
$1N10769: length 2.7
  Top Layer w0.254: R23.1 165.62,101.58 165.63,101.57
$1N10849: length 2.7
  Top Layer w0.254: 162.94,97.21 163.01,97.28 165.63,97.28
$1N10917: length 2.5
  Top Layer w0.254: 165.63,92.99 165.6,92.96 R25.1
$1N10985: length 2.3
  Top Layer w0.254: R26.1 165.62,88.71 165.63,88.7
$1N11233: length 2.3
  Top Layer w0.254: R27.1 165.56,84.34 165.63,84.41
$1N11238: length 2.7
  Top Layer w0.254: 165.63,75.83 162.97,75.83 R29.1
$1N11249: length 2.4
  Top Layer w0.254: 165.63,80.12 163.2,80.12
$1N11257: length 2.6
  Top Layer w0.254: R30.1 163.14,71.54 165.63,71.54
$1N11385: length 2.6
  Top Layer w0.254: 165.63,67.25 165.61,67.22 R31.1
$1N11399: length 2.6
  Top Layer w0.254: R32.1 163.08,62.95 165.63,62.95
$1N11746: length 2.4
  Top Layer w0.254: R33.1 163.09,57.63 U28.1
$1N11995: length 2.6
  Top Layer w0.254: R35.1 165.49,52.5 U29.1
$1N12152: length 2.6
  Top Layer w0.254: U30.1 162.95,47.34 R37.1

## Copper pours and planes (outline as drawn; the poured copper is in the pictures)
DC12V on Top Layer: 64.97,101.83 71.25,101.83 71.25,93.95 64.97,93.95
$2N8052 on Top Layer: 62.36,96.75 76.45,96.75 76.45,89.25 62.36,89.25
$2N8055 on Top Layer: 74.55,92.43 80.26,92.43 80.26,84.17 74.55,84.17
